# EAGLE design xt60_pcb (EAGLE 9.0.0)
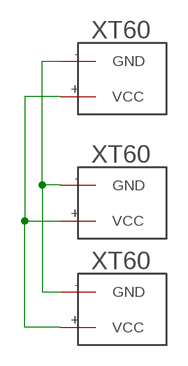
[diagram p0: schematic, sheet 1]

## Parts
U$1  XT60  [XT60]
U$2  XT60  [XT60]
U$3  XT60  [XT60]

## Nets
N$1: U$1.+(VCC) U$2.+(VCC) U$3.+(VCC)
N$2: U$1.-(GND) U$2.-(GND) U$3.-(GND)

## Library data of the parts
U$1-U$3 = XT60:XT60: XT60

## Board
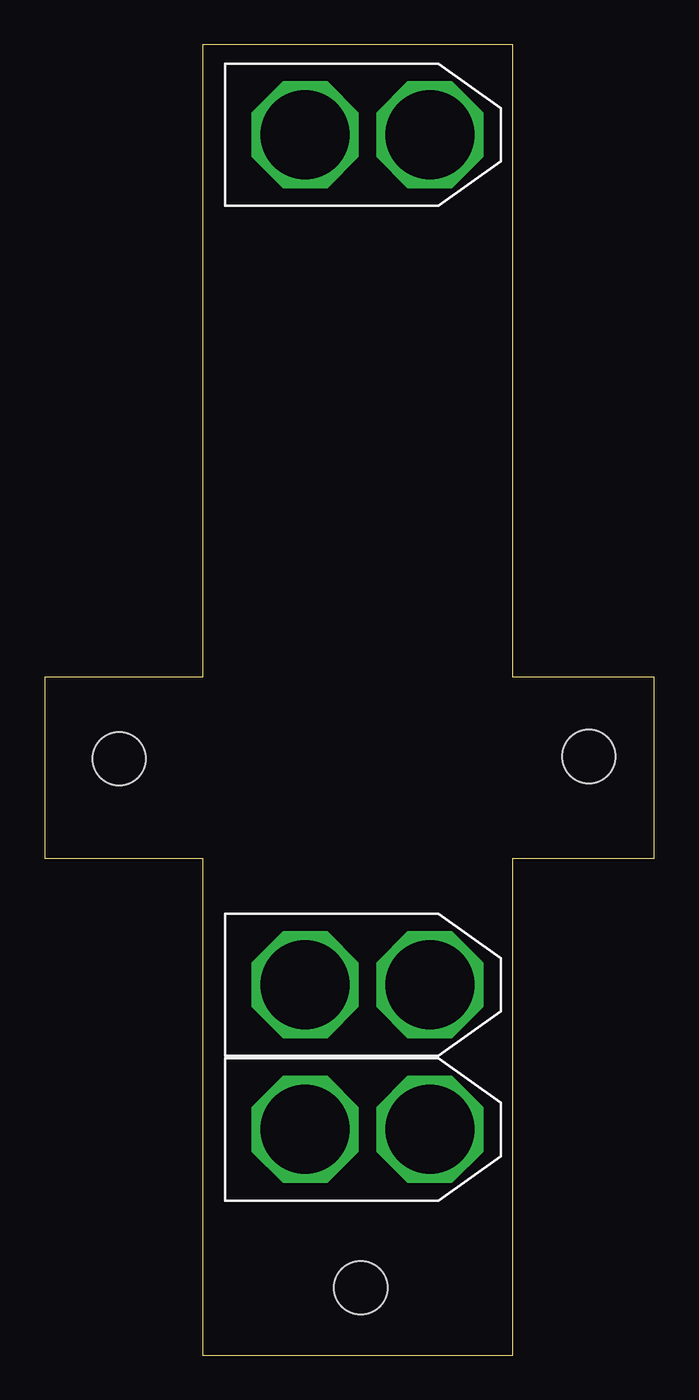
[diagram p1: board, top side]
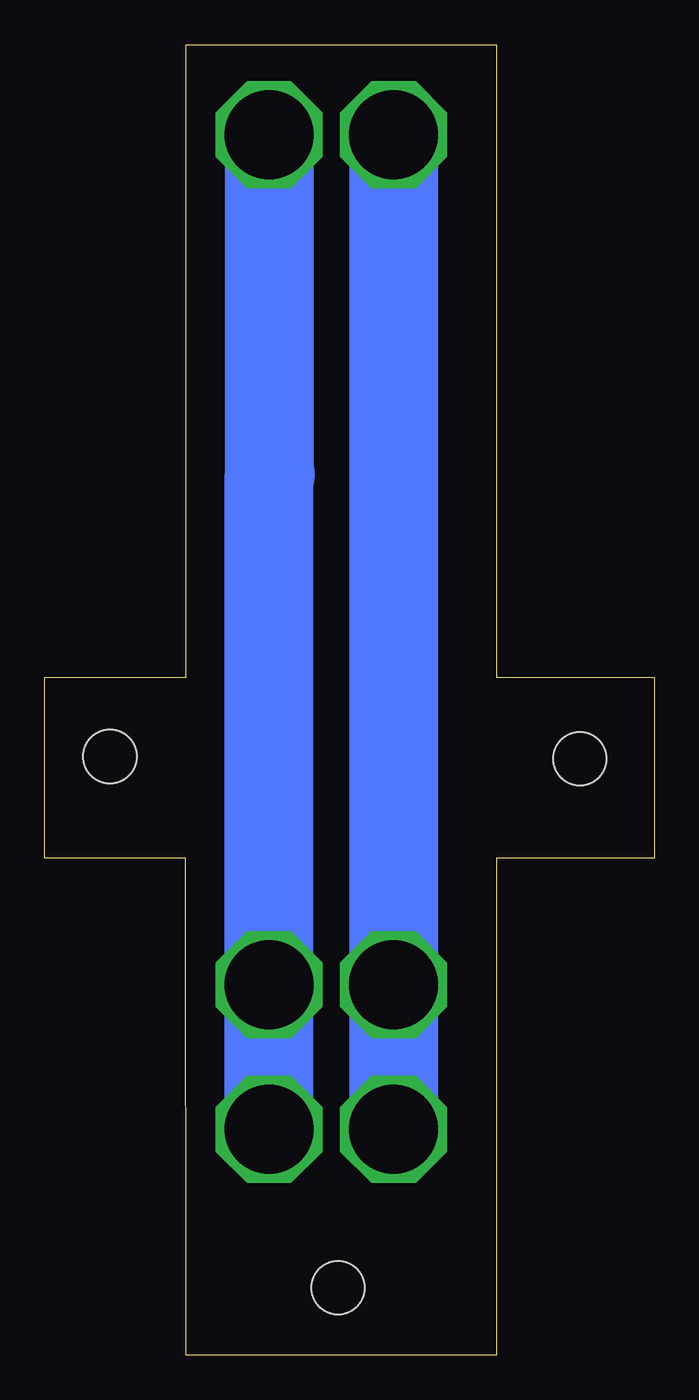
[diagram p2: board, bottom side, seen from below]

Size 34.29 x 73.65 mm. Coordinates in mm from the lower left corner, seen from the top.
Outline: 8.89,0 26.34,0 26.34,27.94 34.29,27.94 34.29,38.1 26.34,38.1 26.34,73.65 8.89,73.65 8.89,38.1 0,38.1 0,27.94 8.89,27.94 8.89,0
Copper layers (1*16): Top 0.035mm / dielectric 1.5mm / Bottom 0.035mm
Design rules "default": minimum track width 6mil, minimum drill 0.35mm, track to track 6mil, track to pad 6mil, pad to pad 6mil, via to via 6mil, smd to smd 6mil, copper to edge 40mil, drill to drill 6mil, minimum pad ring 10mil, minimum via ring 8mil, stop-mask expansion 4mil, vias tented up to drill 0mil, thermal gap 10mil
Holes 3 mm at 17.78,3.81 4.19,33.53 30.61,33.66

### Footprints (pad centres in the part's own frame; a part is rotated, then mirrored left to right if it is on the bottom)
XT60 = drill 5 octagon: + 4.5,0; - 11.5,0

### Placement (x,y rotation side)
U$1  10.16,12.7 0 top
U$2  10.16,20.83 0 top
U$3  10.16,68.58 0 top

### Tracks (layer width: path | path; a pad name or v marks a point on that pad's centre or on a via)
N$1
  Bottom 5: U$1.+ U$2.+ U$3.+
N$2
  Bottom 5: U$1.- U$2.- 21.66,49.53 | 21.66,49.53 21.59,49.53 | U$3.- 21.66,49.53